# EAGLE design rx (EAGLE 9.6.2)
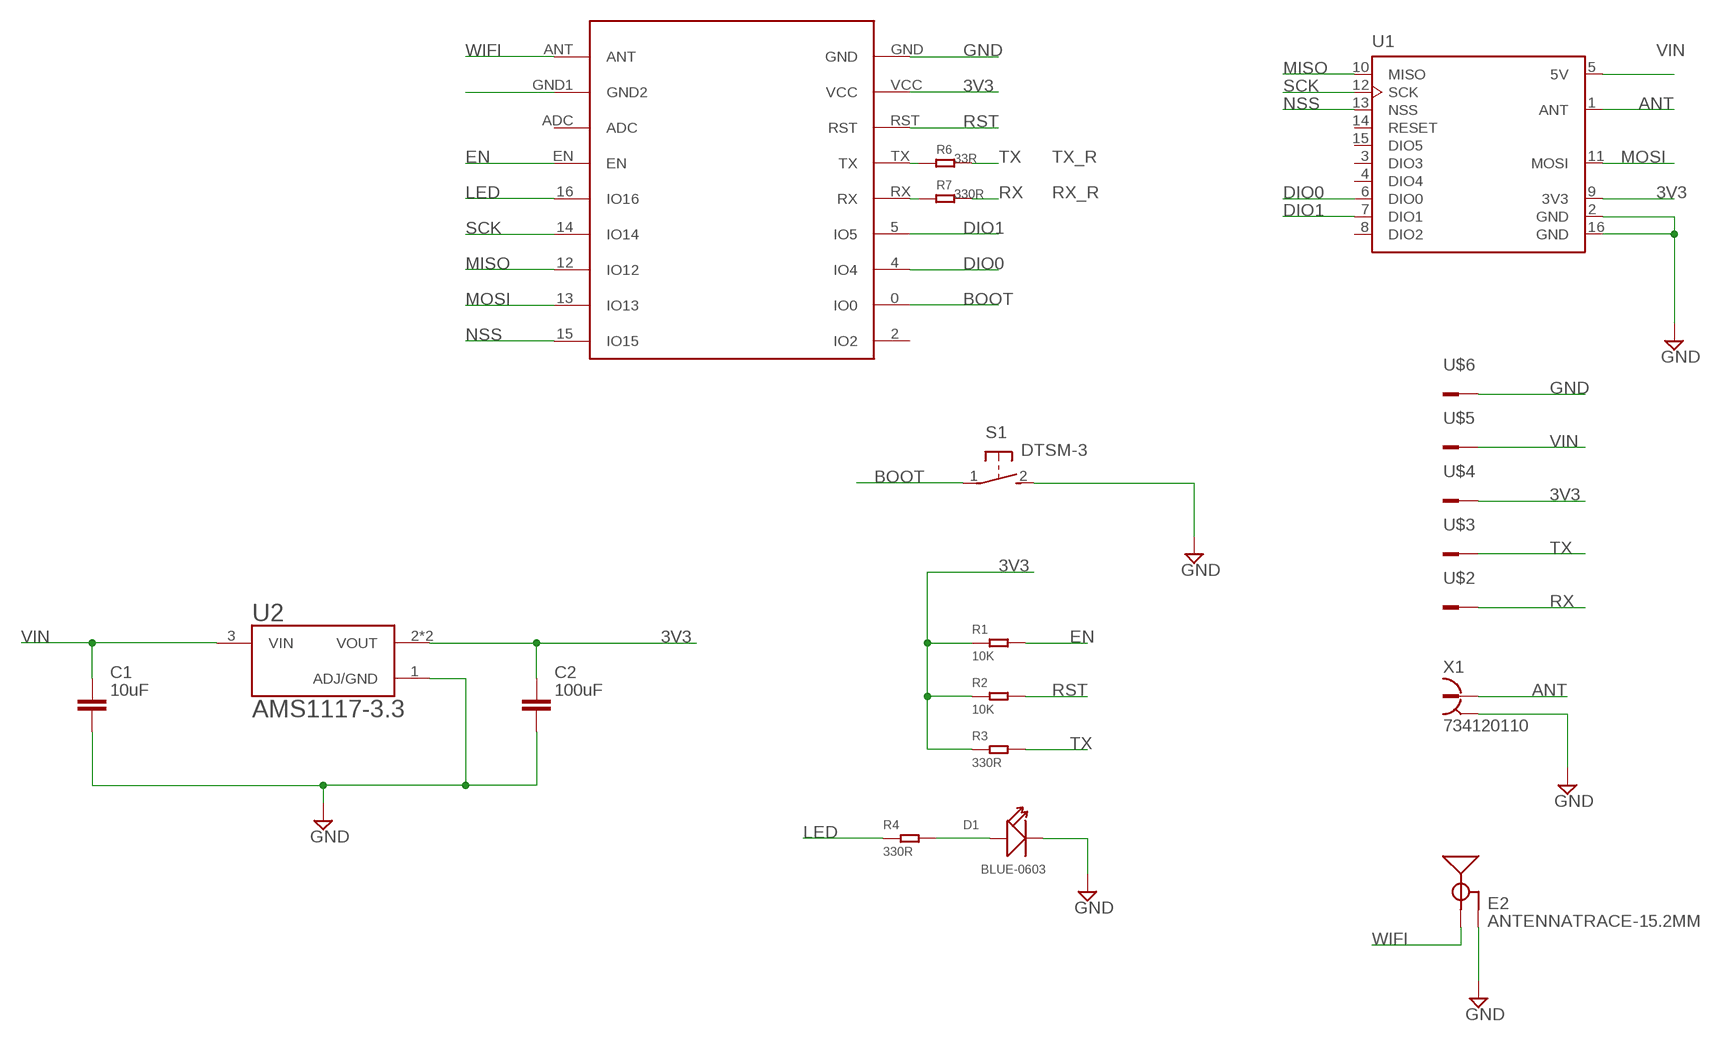
[diagram p0: schematic, sheet 1]

## Parts
C1  10uF  C_TANTALUM-1411(3528-METRIC)  [CAPM3528X210]
C2  100uF  C_TANTALUM-1411(3528-METRIC)  [CAPM3528X210]
D1  BLUE-0603  SMD-LED-CLEAR-BLUE(0603)  [LED-0603]
E2  ANTENNATRACE-15.2MM  [TRACE_ANTENNA_2.4GHZ_15.2MM]
R1  10K  SMD-RES-10K-1%-1/8W(0805)  [R0805]
R2  10K  SMD-RES-10K-1%-1/8W(0805)  [R0805]
R3  330R  SMD-RES-330R-5%-1/8W(0805)  [R0805]
R4  330R  SMD-RES-330R-5%-1/8W(0805)  [R0805]
R6  33R  SMD-RES-330R-5%-1/8W(0805)  [R0805]
R7  330R  SMD-RES-330R-5%-1/8W(0805)  [R0805]
S1  DTSM-3  [DTSM-3]
U1  RFM95PW-868S2PW  [XCVR_RFM95PW-868S2]
U2  AMS1117-3.3  [SOT229P700X180-4N]
U$1  ESP-M2  [ESP-M2]
U$2  CONN-1  [PAD1]
U$3  CONN-1  [PAD1]
U$4  CONN-1  [PAD1]
U$5  CONN-1  [PAD1]
U$6  CONN-1  [PAD1]
X1  734120110  [734120110]

## Nets
3V3: C2.1 R1.1 R2.1 R3.1 U1.9(3V3) U2.2(VOUT) U2.4(VOUT) U$1.VCC U$4.P$1
ANT: U1.1(ANT) X1.1
BOOT: S1.1 U$1.0(IO0)
DIO0: U1.6(DIO0) U$1.4(IO4)
DIO1: U1.7(DIO1) U$1.5(IO5)
EN: R1.2 U$1.EN
GND: C1.2 C2.2 D1.- E2.GND S1.2 U1.2(GND) U1.16(GND) U2.1(ADJ/GND) U$1.GND U$1.GND1(GND2) U$6.P$1 X1.S@1 X1.S@2 X1.S@3
LED: R4.1 U$1.16(IO16)
MISO: U1.10(MISO) U$1.12(IO12)
MOSI: U1.11(MOSI) U$1.13(IO13)
N$1: D1.+ R4.2
NSS: U1.13(NSS) U$1.15(IO15)
RST: R2.2 U$1.RST
RX: R7.2 U$2.P$1
RX_R: R7.1 U$1.RX
SCK: U1.12(SCK) U$1.14(IO14)
TX: R3.2 R6.2 U$3.P$1
TX_R: R6.1 U$1.TX
VIN: C1.1 U1.5(5V) U2.3(VIN) U$5.P$1
WIFI: E2.ANT(SIGNAL) U$1.ANT
Unconnected: U1.3(DIO3) U1.4(DIO4) U1.8(DIO2) U1.14(RESET) U1.15(DIO5) U$1.2(IO2) U$1.ADC

## Library data of the parts
C1 C2 = Capacitor:C: Capacitor - Generic; CATEGORY: Capacitor
D1 = OPL_Optoelectronics:SMD-LED-CLEAR-BLUE(0603): 304090045; MPN: 19-217-BHC-ZL1M2RY-3T
E2 = esp-ant:ANTENNA: Chip antenna Chip antenna with ground or secondary connection. Common with larger metal RF connectors.
R1 R2 = OPL_Resistor:SMD-RES-10K-1%-1/8W(0805): 301012152; MPN: RC0805FR-0710KL
R3 R4 R6 R7 = OPL_Resistor:SMD-RES-330R-5%-1/8W(0805): 301012196; MPN: RC0805JR-071KL; VALUE: 1K
S1 = switch-tact:DTSM-3
U1 = RFM95:RFM95PW-868S2: Mod Txrx Lora +20dbm 868mhz Smd
U2 = AMS1117-3.3:AMS1117-3.3: Sot223/Pkg 1-Amp 3.3-Volt Low Drop Out Voltage Regulatator; AVAILABILITY: Unavailable; DESCRIPTION: Sot223/Pkg 1-Amp 3.3-Volt Low Drop Out Voltage Regulatator; MF: Advanced Monolithic Systems; MP: AMS1117-3.3; PACKAGE: None; PRICE: None
U$1 = ESP-01F:ESP-M2: ESP8285 Module - M2; AVAILABILITY: Unavailable; DESCRIPTION: Wifi Module; MF: Doctors of Intelligence & Technology Co., LTD; MP: ESP-M2; PACKAGE: Package Analog Devices; PRICE: None
U$2-U$6 = wv-connector:CONN-1
X1 = u.fl:734120110: MICRO COAXIAL CONNECTOR RECEPTACLE VERTICAL Source: Data sheet <http://www.molex.com/pdm_docs/sd/734120110_sd.pdf>; AVAILABILITY: Unavailable; DESCRIPTION: U.FL _UMCC_ Connector Receptacle, Male Pin 50Ohm Surface Mount Solder; MF: Molex; MP: 734-12-0110; PACKAGE: None; PRICE: None

## Board
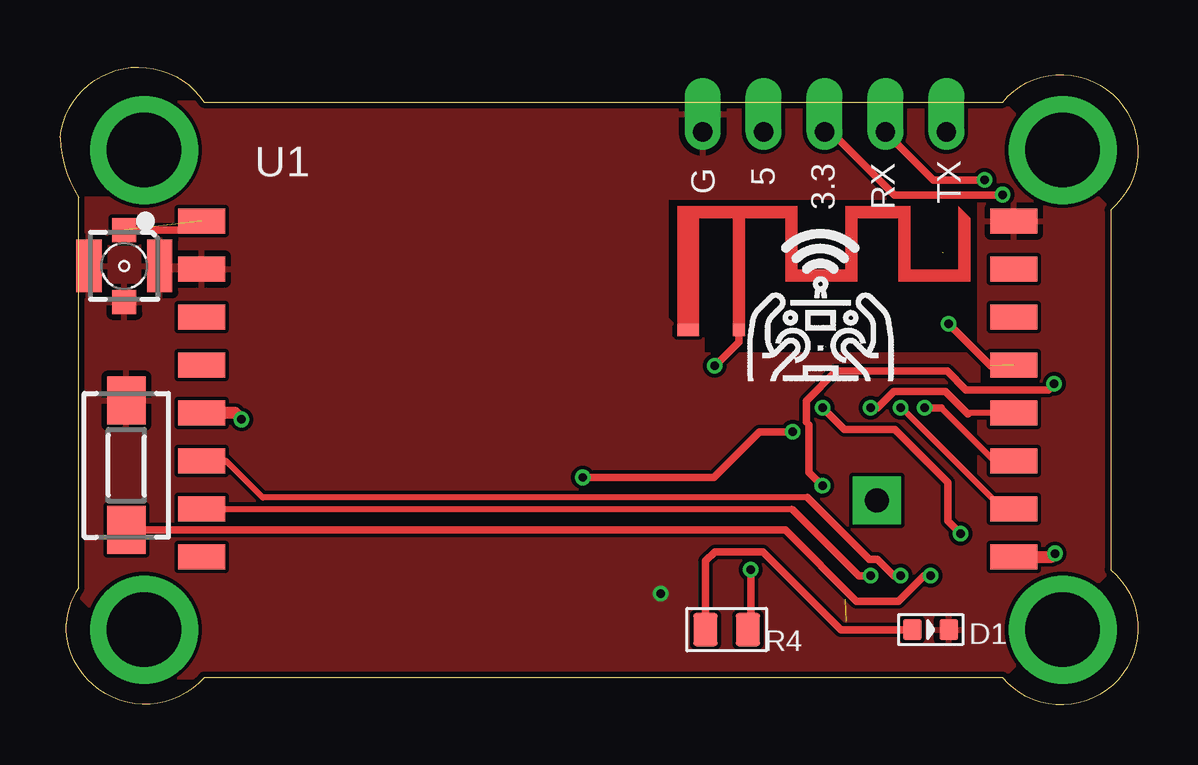
[diagram p1: board, top side]
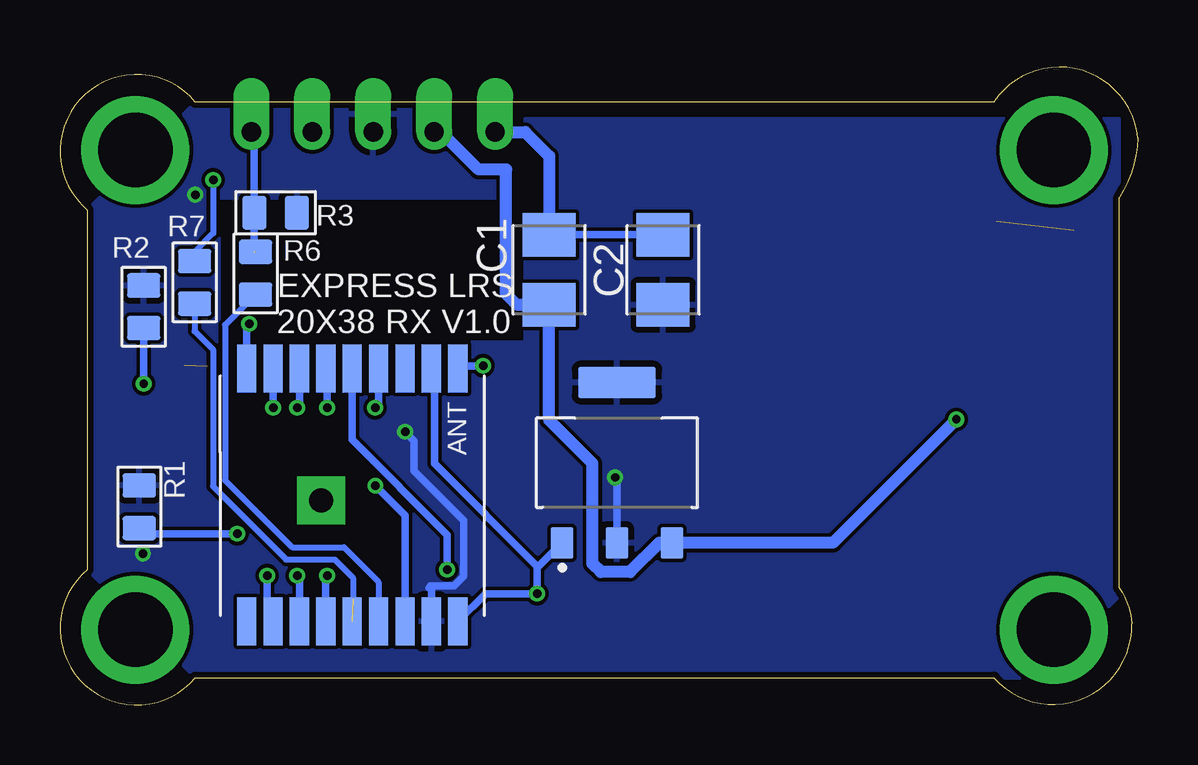
[diagram p2: board, bottom side, seen from below]

Size 44.93 x 26.59 mm. Coordinates in mm from the lower left corner, seen from the top.
Outline: 6,25.14 39.29,25.14 arc-190 43.79,20.64 43.79,5.64 arc-190 39.29,1.14 6,1.14 arc-140 0.25,3.39 arc-30 0.78,4.88 0.78,21.15 arc-30 0,23.65 arc-140 6,25.14
Copper layers (1*16): Top 0.035mm / dielectric 1.5mm / Bottom 0.035mm
Design rules "SeeedStudio_2layer_DRU_no_angle_20140221": minimum track width 6mil, minimum drill 12mil, track to track 6mil, track to pad 6mil, pad to pad 6mil, via to via 6mil, smd to smd 0mil, copper to edge 10mil, drill to drill 10mil, minimum pad ring 10mil, minimum via ring 6mil, stop-mask expansion 2mil, vias tented up to drill 100mil, thermal gap 10mil

### Footprints (pad centres in the part's own frame; a part is rotated, then mirrored left to right if it is on the bottom)
CAPM3528X210 = smd 1.796 x 2.204: 1 -1.46,0; 2 1.46,0
LED-0603 = smd 0.762 x 0.889: + -0.762,0; - 0.762,0
TRACE_ANTENNA_2.4GHZ_15.2MM = smd 0.5 x 0.5: ANT 0,-0.25 | smd 0.9 x 0.5: GND -2.1,-0.25
R0805 = smd 1.397 x 1.016: 1 0,0.889; 2 0,-0.889
DTSM-3 = smd 2 x 1.6: 1 -2.7,0; 2 2.7,0
XCVR_RFM95PW-868S2 = smd 1.95 x 1.05: 1 -7.4,7; 2 -7.4,5; 3 -7.4,3; 4 -7.4,1; 5 -7.4,-1; 6 -7.4,-3; 7 -7.4,-5; 8 -7.4,-7; 9 26.45,-7; 10 26.45,-5; 11 26.45,-3; 12 26.45,-1; 13 26.45,1; 14 26.45,3; 15 26.45,5; 16 26.45,7
SOT229P700X180-4N = smd 0.93 x 1.31: 1 -2.29,-3.345; 2 0,-3.345; 3 2.29,-3.345 | smd 3.24 x 1.31: 4 0,3.345
ESP-M2 = smd 2 x 0.8: 0 5.25,-8.8; 2 5.25,-9.9; 4 5.25,-7.7; 5 5.25,-6.6; 12 -5.3,-7.7; 13 -5.3,-8.8; 14 -5.3,-6.6; 15 -5.3,-9.9; 16 -5.3,-5.5; ADC -5.3,-3.3; ANT -5.3,-1.1; EN -5.3,-4.4; GND -5.3,-2.2; GND1 5.25,-1.1; RST 5.25,-3.3; RX 5.25,-5.5; TX 5.25,-4.4; VCC 5.25,-2.2 | drill 1 pad 2 square: P$1 0.2,-6.8
PAD1 = drill 0.8 pad 1.5 offset: P$1 0,0
734120110 = smd 1 x 1: 1 0,-1.5; S@1 0,1.5 | smd 1.05 x 2.2: S@2 -1.475,0; S@3 1.475,0

### Placement (x,y rotation side)
C1  24.54,18.14 90 bottom
C2  19.79,18.14 90 bottom
D1  36.29,3.14 0 top
E2  28.29,15.89 0 top
R1  41.62,8.26 0 bottom
R2  41.44,16.6 0 bottom
R3  35.94,20.52 270 bottom
R4  27.79,3.14 270 top
R6  36.78,18 180 bottom
R7  39.32,17.62 180 bottom
S1  2.77,9.99 90 top
U1  13.31,13.17 0 top
U2  21.71,10.1 0 bottom
U$1  27.25,8.73 270 bottom
U$2  34.41,23.89 90 top
U$3  36.95,23.89 90 top
U$4  31.87,23.89 90 top
U$5  29.33,23.89 90 top
U$6  26.79,23.89 90 top
X1  2.68,18.3 180 top

### Tracks (layer width: path | path; a pad name or v marks a point on that pad's centre or on a via)
3V3  (via drill 0.35)
  Top 0.305: v21.79,9.48 27.25,9.48 29.15,11.38 30.67,11.38 | v30.54,11.39 29.33,11.39 | U$4.P$1 32.16,23.89 34.79,21.26 39.28,21.26 v39.29,21.27
  Top 0.508: U1.9 41.34,6.17 v41.48,6.31
  Bottom 0.305: U2.2 21.71,9.4 v21.79,9.48 | U$1.VCC 29.45,4.8 29.54,4.89 29.48,4.96 28.51,4.96 28.11,5.36 28.11,7.69 30.16,9.75 30.16,11.01 v30.54,11.39
  pour Bottom: 0.4,21.14 4.4,25.14 4.4,25.14 39.29,25.14 43.66,20.77 43.66,5.51 39.29,1.14 38.29,1.14 38.29,21.14
  pour Bottom: 0.78,24.44 0.78,4.53 4.18,1.14 38.29,1.14 38.29,15.14 25.54,15.14 25.54,24.44
ANT  (1 unrouted)
  Top 0.305: 6.53,19.8 X1.1
BOOT  (via drill 0.35)
  Top 0.305: S1.1 30.24,7.29 33.2,4.33 34.94,4.33 36.01,5.39 v36.29,5.39
  Bottom 0.305: v36.29,5.39 36.29,3.72 U$1.0
DIO0  (via drill 0.35)
  Top 0.254: U1.6 6.92,10.17 8.45,8.65 31.16,8.65
  Top 0.305: 31.16,8.65 33.74,6.07 34.07,6.07 34.76,5.39 v35.04,5.39
  Bottom 0.305: U$1.4 34.95,5.3 v35.04,5.39
DIO1  (via drill 0.35)
  Top 0.152: 30.51,8.17 30.54,8.14
  Top 0.254: U1.7 30.51,8.17
  Top 0.305: v33.79,5.39 33.29,5.39 30.54,8.14
  Bottom 0.305: v33.79,5.39 33.85,5.33 U$1.5
EN  (via drill 0.35)
  Top 0.305: v31.79,12.39 32.7,11.49 34.8,11.49 37.01,9.27 37.01,7.67 v37.54,7.14
  Bottom 0.305: U$1.EN 31.65,12.53 v31.79,12.39 | v37.54,7.14 41.39,7.14 R1.2
GND  (via drill 0.35)
  Bottom 0.305: U2.1 25.04,5.71 v25.04,4.64 | v25.04,4.64 27.19,4.64 U$1.GND1 | U$1.GND 29.32,13.9 29.32,10.07 25.04,5.78 v25.04,4.64 | C2.2 C1.2
  Bottom 0.508: U$6.P$1 25.54,23.89 24.54,22.89 C1.2
  pour Top: 0.27,21.14 38.29,21.14 38.29,1.14 39.29,1.14 43.79,5.64 43.79,20.64 39.29,25.14 4.27,25.14
  pour Top: 25.29,21.14 25.29,16.14 25.54,15.89 26.79,15.89 26.79,14.64 38.29,14.64 38.29,1.14 4.18,1.14 -0.12,5.43 -0.12,21.14
LED  (via drill 0.35)
  Top 0.305: v28.79,5.64 28.79,3.25 R4.1
  Bottom 0.305: U$1.16 32.75,11.06 28.79,7.1 v28.79,5.64
MISO  (via drill 0.35)
  Top 0.152: U1.10 39.31,8.17 | 35.09,12.39 v35.04,12.39
  Top 0.254: 39.31,8.17 35.09,12.39
  Top 0.305: 35.04,12.29 v35.04,12.39
  Bottom 0.305: v35.04,12.39 34.95,12.48 U$1.12
MOSI  (via drill 0.35)
  Top 0.152: U1.11 38.95,10.17
  Top 0.254: 38.95,10.17 36.73,12.39
  Top 0.305: 36.73,12.39 v36.04,12.39
  Bottom 0.305: v36.04,12.39 U$1.13
N$1
  Top 0.305: D1.+ 32.54,3.14 29.29,6.39 27.29,6.39 26.9,6 R4.2
N$2  (via drill 3.1 pad 4.5)
  other vias: 3.5,3.14
N$3  (via drill 3.1 pad 4.5)
  other vias: 3.5,23.14
N$4  (via drill 3.1 pad 4.5)
  other vias: 41.79,3.14
N$5  (via drill 3.1 pad 4.5)
  other vias: 41.79,23.14
NSS  (via drill 0.35)  (1 unrouted)
  Top 0.305: 38.79,14.14 v37.04,15.89
  Bottom 0.305: v37.04,15.89 37.15,15.78 U$1.15
RST  (via drill 0.35)
  Top 0.305: v41.44,13.39 41.19,13.14 37.76,13.14 36.99,13.91 32.35,13.91 31.11,12.67 31.11,11.79 31.23,11.67 31.23,9.7 v31.78,9.14
  Bottom 0.305: R2.2 v41.44,13.39 | v31.78,9.14 30.55,7.91 U$1.RST
RX  (via drill 0.35)
  Top 0.305: v38.54,21.89 36.41,21.89 U$2.P$1
  Bottom 0.254: v38.54,21.89 38.54,19.66 39.32,18.89 R7.2
RX_R  (1 unrouted)
  Bottom 0.254: 32.71,4.41 32.71,5.3 33.48,6.06 35.51,6.06 38.56,9.11 38.56,14.82 39.32,15.59 R7.1
SCK  (via drill 0.35)
  Top 0.152: 37.87,12.17 37.84,12.14
  Top 0.254: U1.12 37.87,12.17
  Top 0.305: v33.79,12.39 34.08,12.39 34.76,13.07 36.91,13.07 37.84,12.14
  Bottom 0.305: v33.79,12.39 33.79,13.97 U$1.14
TX  (1 unrouted)
  Bottom 0.305: 36.77,18.8 36.83,18.86 R3.2 36.83,23.77 U$3.P$1
TX_R
  Bottom 0.254: R6.1 38.05,15.84 38.05,9.36 35.25,6.57 33.09,6.57 31.65,5.13 U$1.TX
VIN  (via drill 0.35)
  Top 0.508: v7.57,11.9 7.3,12.17 U1.5
  Bottom 0.305: U2.3 19.95,6.75
  Bottom 0.508: 19.95,6.75 21.16,5.54 22.39,5.54 22.74,5.89 22.74,10.07 24.54,11.87 C1.1 25.88,16.68 26.33,17.13 26.33,22.33 27.48,22.33 29.05,23.89 U$5.P$1 | v7.57,11.9 12.72,6.75 U2.3
WIFI  (via drill 0.35)
  Top 0.305: E2.ANT 28.29,15.14 v27.29,14.14
  Bottom 0.305: v27.29,14.14 28.24,14.14 U$1.ANT

### Text on the board
tNames: G | 5 | 3.3 | RX | TX
bNames: EXPRESS LRS / 20X38 RX V1.0 | ANT